# Altium project BB8_Control.PrjPCB
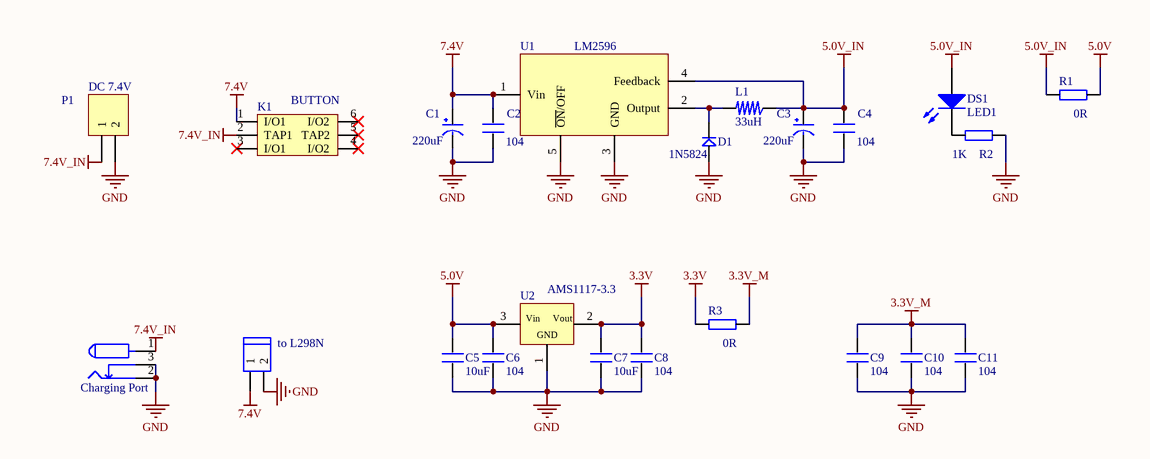
[diagram p0: Power.SchDoc]
2 sheets, 59 parts. Net scope: global (net labels, ports and power ports of the same name join across sheets).
Board file: BB8_Control.PcbDoc
Sheets:
  Power.SchDoc
  MainControl.SchDoc

## Sheet Power.SchDoc
size A4

### Parts
C1  220uF  [CC6.56.5]
C2  104  [0603P]
C3  220uF  [CC6.56.5]
C4  104  [0603P]
C5  10uF  [0603P]
C6  104  [0603P]
C7  10uF  [0603P]
C8  104  [0603P]
C9  104  [0603P]
C10  104  [0603P]
C11  104  [0603P]
D1  1N5824  [DIODE_SOP]
DC_IN1  Charging Port  [DC10B]
DS1  LED1  [SMDLED]
K1  BUTTON  [BTN8.5*8.5]
L1  33uH  [CD54]
P1  DC 7.4V  [XH2.54-2P]
R1  0R  [0603P]
R2  1K  [0603P]
R3  0R  [0603P]
RS1  to L298N  [HEAD2L-0.8]
U1  LM2596  [TO-263-5]
U2  AMS1117-3.3  [SOT223-4L]

### Nets
3.3V: C7.2 C8.2 R3.1 U2.2(Vout)
3.3V_M: C9.2 C10.2 C11.2 R3.2  [project net DVCC]
5.0V: C5.2 C6.2 R1.2 U2.3(Vin)
5.0V_IN: C3.1(VCC) C4.2 DS1.1(A) L1.2 R1.1 U1.4(Feedback)
7.4V: C1.1(VCC) C2.2 K1.1(I/O1) RS1.1 U1.1(Vin)
7.4V_IN: DC_IN1.1 K1.2(TAP1) P1.1
GND: C1.2(GND) C2.1 C3.2(GND) C4.1 C5.1 C6.1 C7.1 C8.1 C9.1 C10.1 C11.1 D1.1 DC_IN1.2 DC_IN1.3 P1.2 R2.2 RS1.2 U1.3(GND) U1.5(~{ON}/OFF) U2.1(GND)  [project net DVSS]
NetD1_2: D1.2 L1.1 U1.2(Output)
NetDS1_2: DS1.2(K) R2.1

Not connected (* = marked no-connect by the designer): K1 3(I/O1)* 4(I/O2)* 5(TAP2)* 6(I/O2)*

### Library data of the parts
C1 C3 = CAP
C2 C4-C11 = C
D1 = D
DC_IN1 = POW
DS1 = LED2: Typical RED, GREEN, YELLOW, AMBER GaAs LED; Published: 8-Jun-2000; LatestRevisionDate: 17-Jul-2002; LatestRevisionNote: Re-released for DXP Platform.; PackageDocument: Feb-2002; PackageReference: 3.2X1.6X1.1; Publisher: Altium Limited
L1 = L
P1 = Header-2: Header, 2-Pin
R1-R3 = R
RS1 = H
U1 = LM2596: LM2596 - 5.0
U2 = AMS1117

## Sheet MainControl.SchDoc
size A4
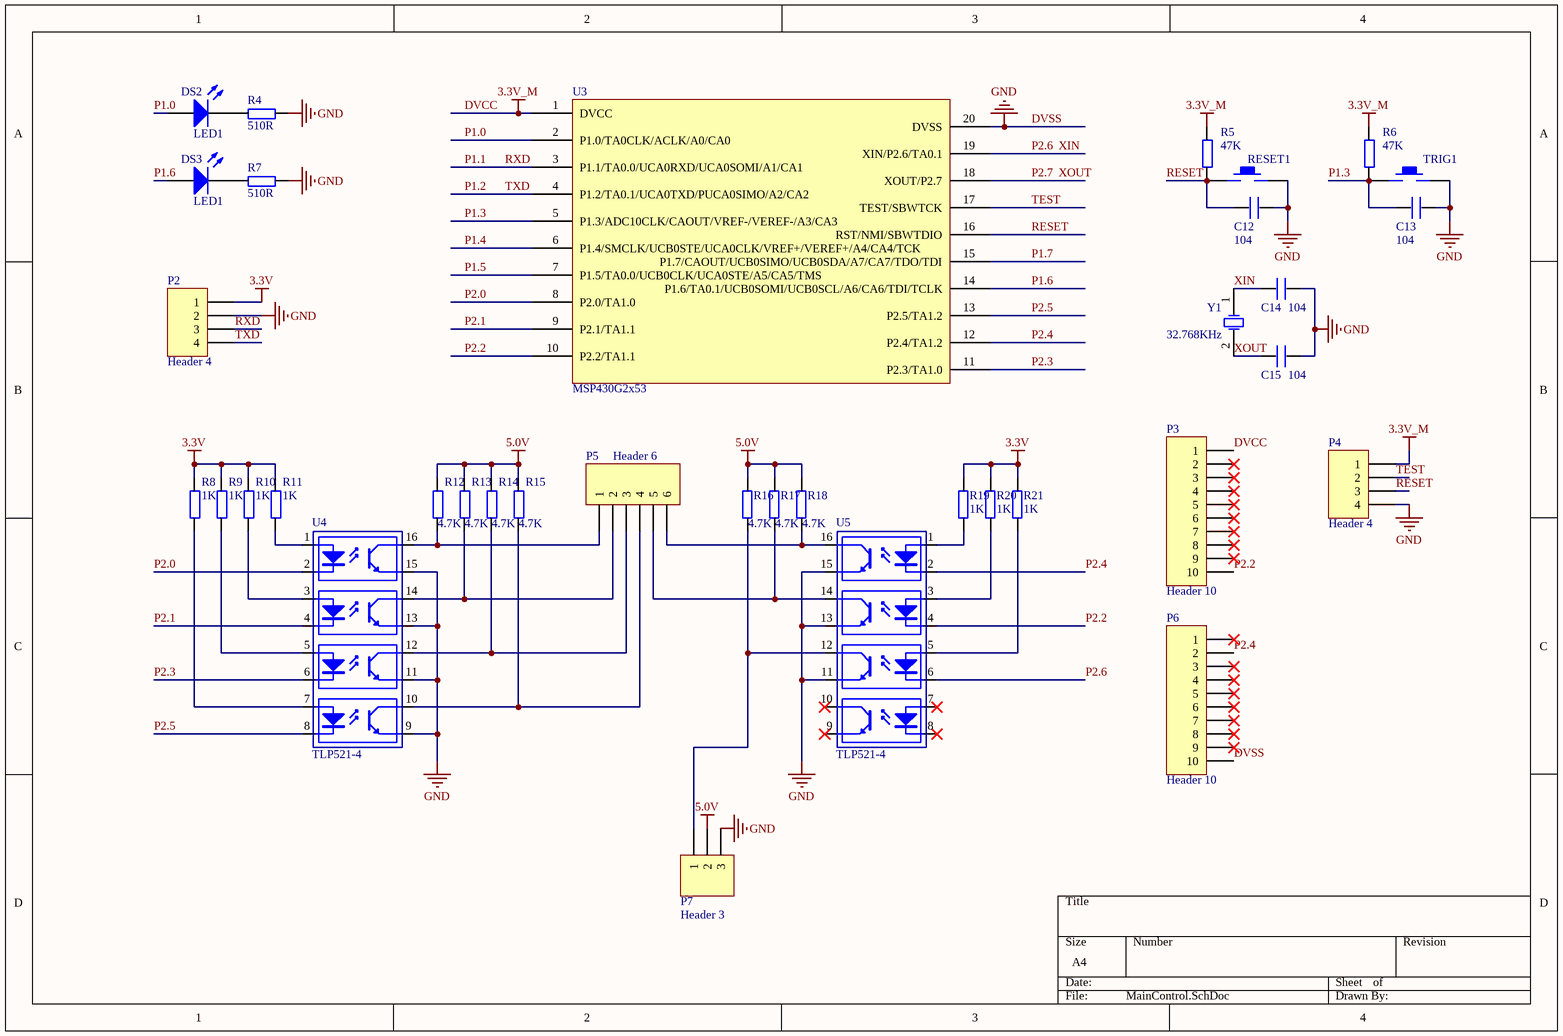
[diagram p1: MainControl.SchDoc]

### Parts
C12  104  [0603P]
C13  104  [0603P]
C14  104  [0603P]
C15  104  [0603P]
DS2  LED1  [SMDLED]
DS3  LED1  [SMDLED]
P2  Header 4  [HDR1X4]
P3  Header 10  [HDR1X10]
P4  Header 4  [HDR1X4]
P5  Header 6  [HDR1X6]
P6  Header 10  [HDR1X10]
P7  Header 3  [HDR1X3]
R4  510R  [0603P]
R5  47K  [0603P]
R6  47K  [0603P]
R7  510R  [0603P]
R8  1K  [0603P]
R9  1K  [0603P]
R10  1K  [0603P]
R11  1K  [0603P]
R12  4.7K  [0603P]
R13  4.7K  [0603P]
R14  4.7K  [0603P]
R15  4.7K  [0603P]
R16  4.7K  [0603P]
R17  4.7K  [0603P]
R18  4.7K  [0603P]
R19  1K  [0603P]
R20  1K  [0603P]
R21  1K  [0603P]
RESET1  KEY_M  [KEY_M]  (value not drawn)
TRIG1  KEY_M  [KEY_M]  (value not drawn)
U3  MSP430G2x53  [MSP430G2x53]
U4  TLP521-4  [DIP16]
U5  TLP521-4  [DIP16]
Y1  32.768KHz  [XTAL32]

### Nets
3.3V: P2.1 R8.2 R9.2 R10.2 R11.2 R19.2 R20.2 R21.2
5.0V: P7.2 R12.2 R13.2 R14.2 R15.2 R16.2 R17.2 R18.2
DVCC: P3.1 P4.1 R5.2 R6.2 U3.1(DVCC)  [also labelled 3.3V_M]
DVSS: C12.1 C13.1 C14.2 C15.2 P2.2 P4.4 P6.10 P7.3 R4.2 R7.2 RESET1.2 TRIG1.2 U3.20(DVSS) U4.9(E) U4.11(E) U4.13(E) U4.15(E) U5.11(E) U5.13(E) U5.15(E)  [also labelled GND]
P1.0: DS2.1(A) U3.2(P1.0/TA0CLK/ACLK/A0/CA0)
P1.1: P2.3 U3.3(P1.1/TA0.0/UCA0RXD/UCA0SOMI/A1/CA1)  [also labelled RXD]
P1.2: P2.4 U3.4(P1.2/TA0.1/UCA0TXD/PUCA0SIMO/A2/CA2)  [also labelled TXD]
P1.3: C13.2 R6.1 TRIG1.1 U3.5(P1.3/ADC10CLK/CAOUT/VREF-/VEREF-/A3/CA3)
P1.4: U3.6(P1.4/SMCLK/UCB0STE/UCA0CLK/VREF+/VEREF+/A4/CA4/TCK)
P1.5: U3.7(P1.5/TA0.0/UCB0CLK/UCA0STE/A5/CA5/TMS)
P1.6: DS3.1(A) U3.14(P1.6/TA0.1/UCB0SOMI/UCB0SCL/A6/CA6/TDI/TCLK)
P1.7: U3.15(P1.7/CAOUT/UCB0SIMO/UCB0SDA/A7/CA7/TDO/TDI)
P2.0: U3.8(P2.0/TA1.0) U4.2(K)
P2.1: U3.9(P2.1/TA1.1) U4.4(K)
P2.2: P3.10 U3.10(P2.2/TA1.1) U5.4(K)
P2.3: U3.11(P2.3/TA1.0) U4.6(K)
P2.4: P6.2 U3.12(P2.4/TA1.2) U5.2(K)
P2.5: U3.13(P2.5/TA1.2) U4.8(K)
P2.6: C14.1 U3.19(XIN/P2.6/TA0.1) U5.6(K) Y1.1(OSC1)  [also labelled XIN]
P2.7: C15.1 U3.18(XOUT/P2.7) Y1.2(OSC2)  [also labelled XOUT]
RESET: C12.2 P4.3 R5.1 RESET1.1 U3.16(RST/NMI/SBWTDIO)
TEST: P4.2 U3.17(TEST/SBWTCK)
NetDS2_2: DS2.2(K) R4.1
NetDS3_2: DS3.2(K) R7.1
NetP5_1: P5.1 R12.1 U4.16(C)
NetP5_2: P5.2 R13.1 U4.14(C)
NetP5_3: P5.3 R14.1 U4.12(C)
NetP5_4: P5.4 R15.1 U4.10(C)
NetP5_5: P5.5 R17.1 U5.14(C)
NetP5_6: P5.6 R18.1 U5.16(C)
NetP7_1: P7.1 R16.1 U5.12(C)
NetR8_1: R8.1 U4.7(A)
NetR9_1: R9.1 U4.5(A)
NetR10_1: R10.1 U4.3(A)
NetR11_1: R11.1 U4.1(A)
NetR19_1: R19.1 U5.1(A)
NetR20_1: R20.1 U5.3(A)
NetR21_1: R21.1 U5.5(A)

Not connected (* = marked no-connect by the designer): P3 2* 3* 4* 5* 6* 7* 8* 9*; P6 1* 3* 4* 5* 6* 7* 8* 9*; U5 7(A)* 8(K)* 9(E)* 10(C)*

### Library data of the parts
C12-C15 = C
DS2 DS3 = LE: Typical RED, GREEN, YELLOW, AMBER GaAs LED; Published: 8-Jun-2000; LatestRevisionDate: 17-Jul-2002; LatestRevisionNote: Re-released for DXP Platform.; PackageDocument: Feb-2002; PackageReference: 3.2X1.6X1.1; Publisher: Altium Limited
P2 P4 = Header 4: Header, 4-Pin; LatestRevisionDate: 17-Jul-2002; LatestRevisionNote: Re-released for DXP Platform.; Publisher: Altium Limited
P3 P6 = Header 10: Header, 10-Pin; LatestRevisionDate: 17-Jul-2002; LatestRevisionNote: Re-released for DXP Platform.; Publisher: Altium Limited
P5 = Header 6: Header, 6-Pin; LatestRevisionDate: 17-Jul-2002; LatestRevisionNote: Re-released for DXP Platform.; Publisher: Altium Limited
P7 = Header 3: Header, 3-Pin; LatestRevisionDate: 17-Jul-2002; LatestRevisionNote: Re-released for DXP Platform.; Publisher: Altium Limited
R4-R21 = R
RESET1 TRIG1 = K
U3 = MSP430G2x53: MSP430G2x53 microcontrollers
U4 U5 = TLP521-4: 4 x 4-Pin Phototransistor Optocoupler; Published: 24-Mar-1999; LatestRevisionDate: 04-Mar-2005; LatestRevisionNote: Sch pins 3 & 4 Swapped.; DatasheetVersion: Nov-2003; PackageReference: DIP-4; Publisher: Altium Limited
Y1 = XT: Crystal Oscillator; Published: 8-Jun-2000; LatestRevisionDate: 17-Jul-2002; LatestRevisionNote: Re-released for DXP Platform.; Publisher: Altium Limited

## Nets that join several sheets
3.3V: Power (C7.2 C8.2 R3.1 U2.2), MainControl (8 pins)
5.0V: Power (C5.2 C6.2 R1.2 U2.3), MainControl (8 pins)
DVCC: Power (C9.2 C10.2 C11.2 R3.2), MainControl (5 pins)
DVSS: Power (20 pins), MainControl (20 pins)